# EAGLE design Particle-Photon-Carrier (EAGLE 9.6.2)
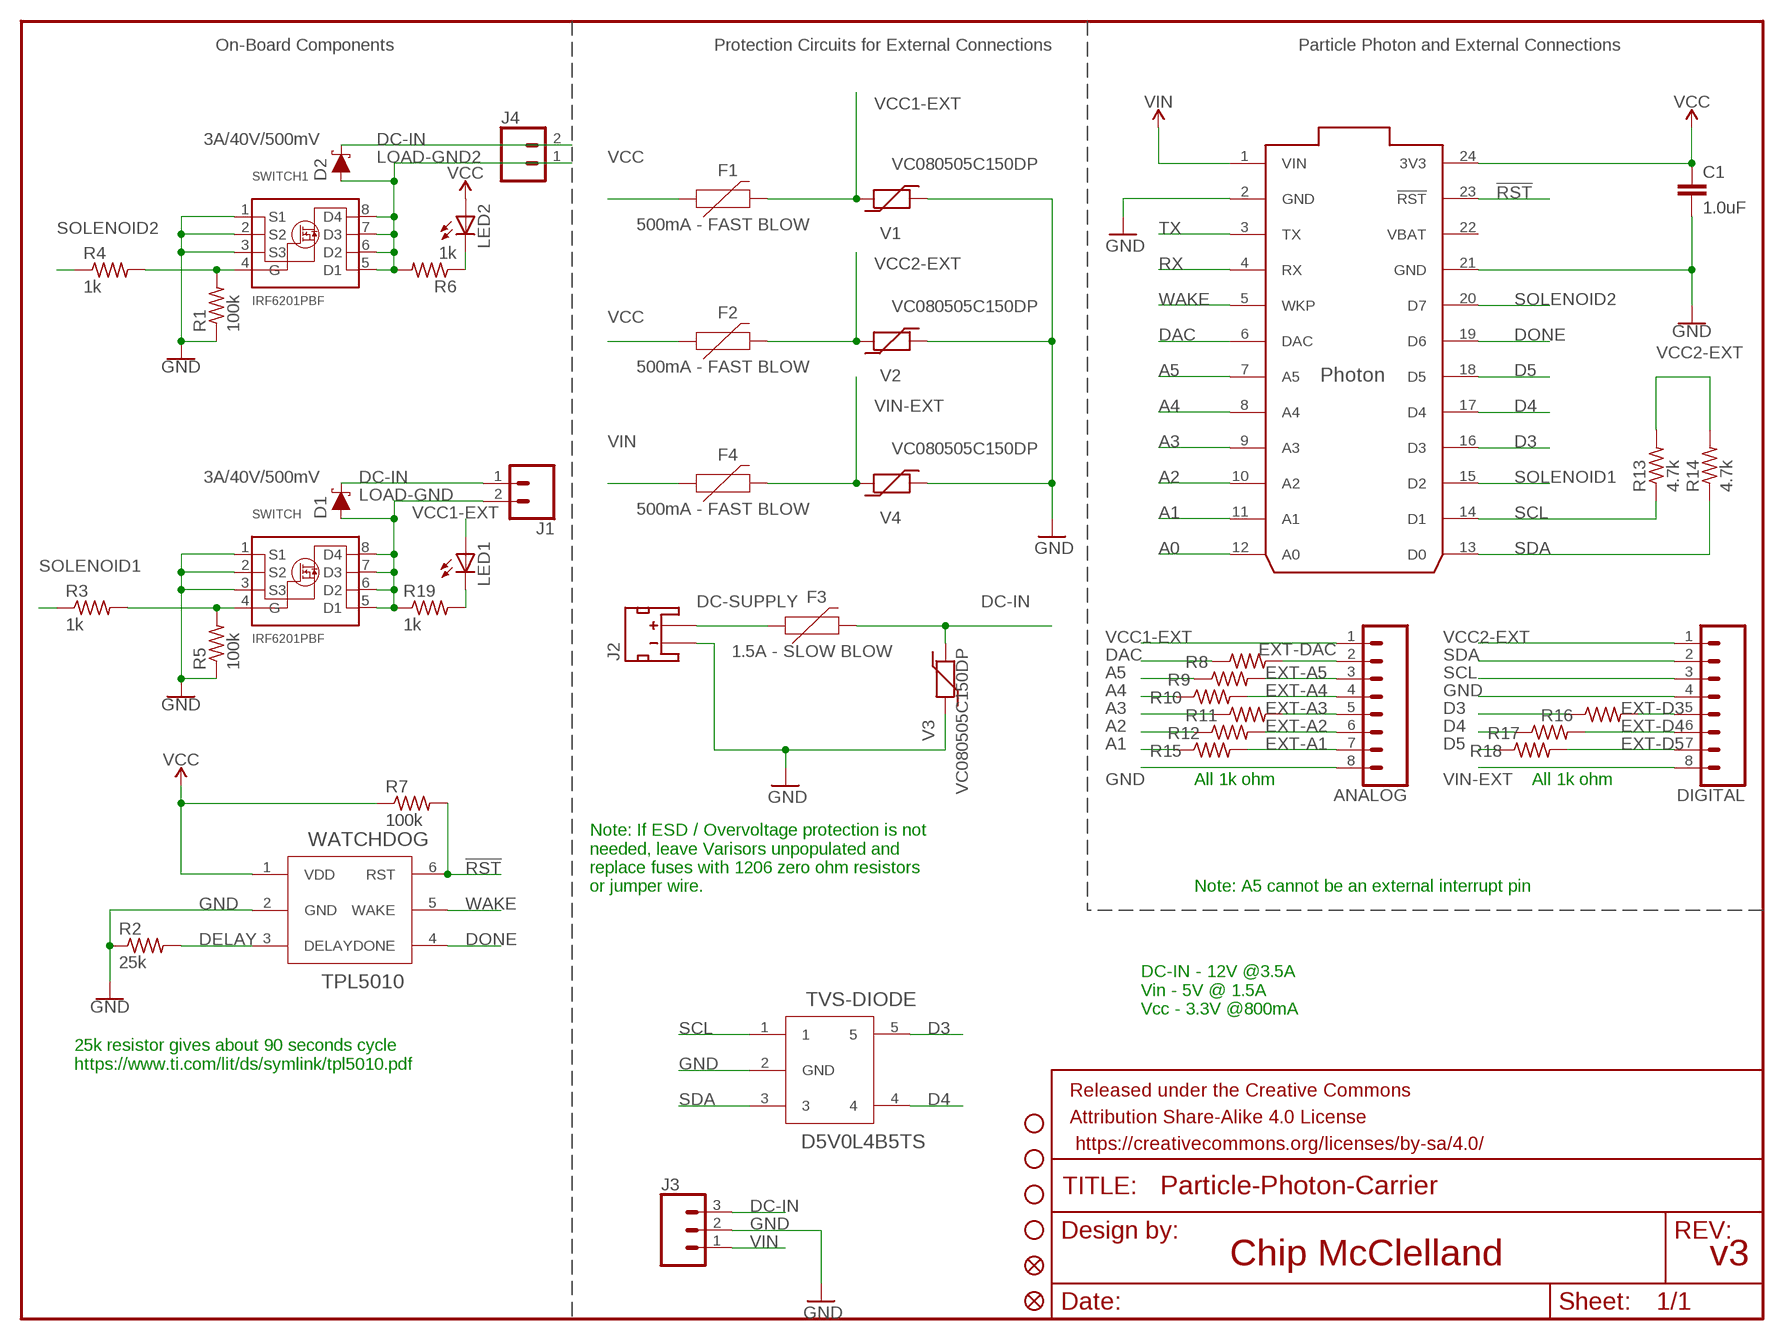
[diagram p0: schematic, sheet 1]

## Parts
ANALOG  CONN_083.5MM-8  [SCREWTERMINAL-3.5MM-8]
C1  1.0uF  1.0UF-0805-25V-10%  [0805]
D1  3A/40V/500mV  DIODE-SCHOTTKY-B340A  [SMA-DIODE]
D2  3A/40V/500mV  DIODE-SCHOTTKY-B340A  [SMA-DIODE]
DIGITAL  CONN_083.5MM-8  [SCREWTERMINAL-3.5MM-8]
F1  500mA - FAST BLOW  PPTC_HALF-AMP  [1206]
F2  500mA - FAST BLOW  PPTC_HALF-AMP  [1206]
F3  1.5A - SLOW BLOW  PPTC_HALF-AMP  [1206]
F4  500mA - FAST BLOW  PPTC_HALF-AMP  [1206]
FD1  FIDUCIALUFIDUCIAL  [FIDUCIAL-MICRO]
FD2  FIDUCIALUFIDUCIAL  [FIDUCIAL-MICRO]
FRAME1  FRAME-LETTER  [CREATIVE_COMMONS]
J1  CONN_023.5MM  [SCREWTERMINAL-3.5MM-2]
J2  5V @ 2A  JST_2MM_MALE  [JST-2-SMD]
J3  CONN_03LOCK  [1X03_LOCK]
J4  CONN_023.5MM  [SCREWTERMINAL-3.5MM-2]
JP3  STAND-OFF  [STAND-OFF]
JP4  STAND-OFF  [STAND-OFF]
JP5  STAND-OFF  [STAND-OFF]
JP6  STAND-OFF  [STAND-OFF]
LED1  LEDCHIPLED_0805  [CHIPLED_0805]
LED2  LEDCHIPLED_0805  [CHIPLED_0805]
PHOTON  PHOTON_WITH_HEADERS  [PHOTON]
R1  100k  R-US_R0805  [R0805]
R2  25k  R-US_R0805  [R0805]
R3  1k  R-US_R0805  [R0805]
R4  1k  R-US_R0805  [R0805]
R5  100k  R-US_R0805  [R0805]
R6  1k  R-US_R0805  [R0805]
R7  100k  R-US_R0805  [R0805]
R8  1k  R-US_R0805  [R0805]
R9  1k  R-US_R0805  [R0805]
R10  1k  R-US_R0805  [R0805]
R11  1k  R-US_R0805  [R0805]
R12  1k  R-US_R0805  [R0805]
R13  4.7k  R-US_R0805  [R0805]
R14  4.7k  R-US_R0805  [R0805]
R15  1k  R-US_R0805  [R0805]
R16  1k  R-US_R0805  [R0805]
R17  1k  R-US_R0805  [R0805]
R18  1k  R-US_R0805  [R0805]
R19  1k  R-US_R0805  [R0805]
SWITCH  IRF6201PBF  [SO8-GW300]
SWITCH1  IRF6201PBF  [SO8-GW300]
TVS-DIODE  D5V0L4B5TS  [SOT-23-5]
V1  VC080505C150DP  VARISTOR  [0805]
V2  VC080505C150DP  VARISTOR  [0805]
V3  VC080505C150DP  VARISTOR  [0805]
V4  VC080505C150DP  VARISTOR  [0805]
WATCHDOG  TPL5010  [TSOT-23]

## Nets
!RST: PHOTON.23(!RST) R7.2 WATCHDOG.6(RST)
A0: PHOTON.12(A0)
A1: PHOTON.11(A1) R15.1
A2: PHOTON.10(A2) R12.1
A3: PHOTON.9(A3) R11.1
A4: PHOTON.8(A4) R10.1
A5: PHOTON.7(A5) R9.1
D3: PHOTON.16(D3) R16.1 TVS-DIODE.5
D4: PHOTON.17(D4) R17.1 TVS-DIODE.4
D5: PHOTON.18(D5) R18.1
DAC: PHOTON.6(DAC) R8.1
DC-IN: D1.C D2.C F3.2 J1.1 J3.3 J4.2 V3.2
DC-SUPPLY: F3.1 J2.2(+)
DELAY: R2.2 WATCHDOG.3(DELAY)
DONE: PHOTON.19(D6) WATCHDOG.4(DONE)
EXT-A1: ANALOG.7 R15.2
EXT-A2: ANALOG.6 R12.2
EXT-A3: ANALOG.5 R11.2
EXT-A4: ANALOG.4 R10.2
EXT-A5: ANALOG.3 R9.2
EXT-D3: DIGITAL.5 R16.2
EXT-D4: DIGITAL.6 R17.2
EXT-D5: DIGITAL.7 R18.2
EXT-DAC: ANALOG.2 R8.2
GATE: R3.2 R5.2 SWITCH.4(G)
GATE1: R1.2 R4.2 SWITCH1.4(G)
GND: ANALOG.8 C1.2 DIGITAL.4 J2.1(-) J3.2 PHOTON.2(GND) PHOTON.21(GND) R1.1 R2.1 R5.1 SWITCH1.1(S1) SWITCH1.2(S2) SWITCH1.3(S3) SWITCH.1(S1) SWITCH.2(S2) SWITCH.3(S3) TVS-DIODE.2(GND) V1.1 V2.1 V3.1 V4.1 WATCHDOG.2(GND)
LOAD-GND: D1.A J1.2 R19.1 SWITCH.5(D1) SWITCH.6(D2) SWITCH.7(D3) SWITCH.8(D4)
LOAD-GND2: D2.A J4.1 R6.2 SWITCH1.5(D1) SWITCH1.6(D2) SWITCH1.7(D3) SWITCH1.8(D4)
N$1: LED2.C R6.1
N$2: LED1.C R19.2
RX: PHOTON.4(RX)
SCL: DIGITAL.3 PHOTON.14(D1) R13.1 TVS-DIODE.1
SDA: DIGITAL.2 PHOTON.13(D0) R14.1 TVS-DIODE.3
SOLENOID1: PHOTON.15(D2) R3.1
SOLENOID2: PHOTON.20(D7) R4.1
TX: PHOTON.3(TX)
VCC: C1.1 F1.1 F2.1 LED2.A PHOTON.24(3V3) R7.1 WATCHDOG.1(VDD)
VCC1-EXT: ANALOG.1 F1.2 LED1.A V1.2
VCC2-EXT: DIGITAL.1 F2.2 R13.2 R14.2 V2.2
VIN: F4.1 J3.1 PHOTON.1(VIN)
VIN-EXT: DIGITAL.8 F4.2 V4.2
WAKE: PHOTON.5(WKP) WATCHDOG.5(WAKE)
Unconnected: J2.NC1(PAD1) J2.NC2(PAD2)

## Notes on the sheet
- On-Board Components | Protection Circuits for External Connections | Particle Photon and External Connections
- All 1k ohm | All 1k ohm
- Note: If ESD / Overvoltage protection is not 
  needed, leave Varisors unpopulated and
  replace fuses with 1206 zero ohm resistors
  or jumper wire.
- Note: A5 cannot be an external interrupt pin
- DC-IN - 12V @3.5A
  Vin - 5V @ 1.5A
  Vcc - 3.3V @800mA
- 25k resistor gives about 90 seconds cycle
  https://www.ti.com/lit/ds/symlink/tpl5010.pdf
- Chip McClelland | v3

## Power pins joined to a net without a drawn wire
VBAT: PHOTON.22(VBAT)

## Library data of the parts
ANALOG DIGITAL = SparkFun-Connectors:CONN_08: Multi connection point. Often used as Generic Header-pin footprint for 0.1 inch spaced/style header connections On any of the 0.1 inch spaced packages, you can populate with these: Break Away Headers - Straight <https://www.sparkfun.com/products/116> (PRT-00116) Break Away Male Headers - Right Angle <https://www.sparkfun.com/products/553> (PRT-00553) Female Headers <https://www.sparkfun.com/products/115> (PRT-00115) Break Away Headers - Machine Pin <https://www.sparkfun.com/products/117> (PRT-00117) Break Away Female Headers - Swiss Machine Pin <https://www.sparkfun.com/products/743> (PRT-00743) Arduino Stackable Header - 8 Pin <https://www.sparkfun.com/products/9279> (PRT-09279) For SCREWTERMINALS and SPRING TERMINALS visit here: Screw Terimnals on SparkFun.com <https://www.sparkfun.com/search/results?term=Screw+Terminals> (5mm/3.5mm/2.54mm spacing) This device is also useful as a general connection point to wire up your design to another part of your project. Our various solder wires solder well into these plated through hole pads. Hook-Up Wire - Assortment (Stranded, 22 AWG) <https://www.sparkfun.com/products/11375> (PRT-11375) Hook-Up Wire - Assortment (Solid Core, 22 AWG) <https://www.sparkfun.com/products/11367> (PRT-11367) View the entire wire category on our website here <https://www.sparkfun.com/categories/141> Special notes: Molex polarized connector foot print use with SKU : PRT-08231 with associated crimp pins and housings. 1MM SMD Version SKU: PRT-10208 NOTES ON THE VARIANTS LOCK and LOCK_LONGPADS... This footprint was designed to help hold the alignment of a through-hole component (i.e. 6-pin header) while soldering it into place. You may notice that each hole has been shifted either up or down by 0.005 of an inch from it's more standard position (which is a perfectly straight line). This slight alteration caused the pins (the squares in the middle) to touch the edges of the holes. Because they are alternating, it causes a "brace" to hold the component in place. 0.005 has proven to be the perfect amount of "off-center" position when using our standard breakaway headers. Although looks a little odd when you look at the bare footprint, once you have a header in there, the alteration is very hard to notice. Also,if you push a header all the way into place, it is covered up entirely on the bottom side.
C1 = SparkFun-Capacitors:1.0UF: 1µF ceramic capacitors A capacitor is a passive two-terminal electrical component used to store electrical energy temporarily in an electric field.; PROD_ID: CAP-08064
D1 D2 = SparkFun-DiscreteSemi:DIODE-SCHOTTKY: Schottky diode A Schottky diode is a semiconductor diode which has a low forward voltage drop and a very fast switching action.; PROD_ID: DIO-09886
F1-F4 = SparkFun-Fuses:PPTC: Resettable Fuse PPTC Resettable Fuse. Really a sort of resistor with a polymeric positive temperature coefficient whose resistance increases dramatically with an increase in temperature. When heated by the power passing through the resistance rises causing the current to be limited, protecting the circuit. This is achieved by the transition of the polymer from a crystalline to an amorphous state where the conductive carbon separates breaking the conductive pathways found in the cool crystalline structure. When a PPTC cools back down it resumes conducting letting the circuit turn back on. SparkFun Products: SparkFun RedBoard - Programmed with Arduino <https://www.sparkfun.com/products/12757> Pro Micro - 5V/16MHz <https://www.sparkfun.com/products/12640> Arduino Pro 328 - 5V/16MHz <https://www.sparkfun.com/products/10915> MP3 Trigger <https://www.sparkfun.com/products/13720>; PROD_ID: RES-08585; VALUE: 6V/0.5A
FD1 FD2 = SparkFun-Aesthetics:FIDUCIAL: Fiducial Alignment Points Point-of-reference for pick-and-place machines and other optical instruments.
FRAME1 = SparkFun-Aesthetics:FRAME-LETTER: Schematic Frame - Letter Standard 8.5x11 US Letter frame
J1 J4 = SparkFun-Connectors:CONN_02: Multi connection point. Often used as Generic Header-pin footprint for 0.1 inch spaced/style header connections On any of the 0.1 inch spaced packages, you can populate with these: Break Away Headers - Straight <https://www.sparkfun.com/products/116> (PRT-00116) Break Away Male Headers - Right Angle <https://www.sparkfun.com/products/553> (PRT-00553) Female Headers <https://www.sparkfun.com/products/115> (PRT-00115) Break Away Headers - Machine Pin <https://www.sparkfun.com/products/117> (PRT-00117) Break Away Female Headers - Swiss Machine Pin <https://www.sparkfun.com/products/743> (PRT-00743) For SCREWTERMINALS and SPRING TERMINALS visit here: Screw Terimnals on SparkFun.com <https://www.sparkfun.com/search/results?term=Screw+Terminals> (5mm/3.5mm/2.54mm spacing) This device is also useful as a general connection point to wire up your design to another part of your project. Our various solder wires solder well into these plated through hole pads. Hook-Up Wire - Assortment (Stranded, 22 AWG) <https://www.sparkfun.com/products/11375> (PRT-11375) Hook-Up Wire - Assortment (Solid Core, 22 AWG) <https://www.sparkfun.com/products/11367> (PRT-11367) View the entire wire category on our website here <https://www.sparkfun.com/categories/141> Special notes: Molex polarized connector foot print use with: PRT-08233 with associated crimp pins and housings. 2.54_SCREWTERM for use with PRT-10571. 3.5mm Screw Terminal footprints for PRT-08084 5mm Screw Terminal footprints for use with PRT-08432; PROD_ID: CONN-08399
J2 = SparkFun-Connectors:JST_2MM_MALE: JST 2MM MALE RA CONNECTOR Two pin, compact surface mount connector. Commonly used as a battery input connection point. We really like the solid locking feeling and high current rating on these small connectors. We use these all the time as battery connectors. Mates to single-cell LiPo batteries. Here is the connector we sell at SparkFun: JST Right Angle Connector - White <https://www.sparkfun.com/products/8612> (PRT-08612) Datasheet <http://www.sparkfun.com/datasheets/Prototyping/Connectors/JST-Horizontal.pdf> It was used on these SparkFun products: SparkFun MOSFET Power Controller <https://www.sparkfun.com/products/11214> (PRT-11214) SparkFun Battery Babysitter - LiPo Battery Manager <https://www.sparkfun.com/products/13777> (PRT-13777) And many, many others that required a lipo battery connection.; PROD_ID: CONN-11443; SF_ID: PRT-08612
J3 = SparkFun-Connectors:CONN_03: Multi connection point. Often used as Generic Header-pin footprint for 0.1 inch spaced/style header connections On any of the 0.1 inch spaced packages, you can populate with these: Break Away Headers - Straight <https://www.sparkfun.com/products/116> (PRT-00116) Break Away Male Headers - Right Angle <https://www.sparkfun.com/products/553> (PRT-00553) Female Headers <https://www.sparkfun.com/products/115> (PRT-00115) Break Away Headers - Machine Pin <https://www.sparkfun.com/products/117> (PRT-00117) Break Away Female Headers - Swiss Machine Pin <https://www.sparkfun.com/products/743> (PRT-00743) Stackable Header - 3 Pin (Female, 0.1") <https://www.sparkfun.com/products/13875> (PRT-13875) For SCREWTERMINALS and SPRING TERMINALS visit here: Screw Terimnals on SparkFun.com <https://www.sparkfun.com/search/results?term=Screw+Terminals> (5mm/3.5mm/2.54mm spacing) This device is also useful as a general connection point to wire up your design to another part of your project. Our various solder wires solder well into these plated through hole pads. Hook-Up Wire - Assortment (Stranded, 22 AWG) <https://www.sparkfun.com/products/11375> (PRT-11375) Hook-Up Wire - Assortment (Solid Core, 22 AWG) <https://www.sparkfun.com/products/11367> (PRT-11367) View the entire wire category on our website here <https://www.sparkfun.com/categories/141> Special notes: Molex polarized connector foot print use with SKU : PRT-08232 with associated crimp pins and housings.
JP3-JP6 = SparkFun:STAND-OFF: Stand Off This is the mechanical footprint for a #4 phillips button head screw. Use the keepout ring to avoid running the screw head into surrounding components. SKU : PRT-00447
LED1 LED2 = adafruit:LED: LED OSRAM: - CHIPLED LG R971, LG N971, LY N971, LG Q971, LY Q971, LO R971, LY R971 LH N974, LH R974 LS Q976, LO Q976, LY Q976 LO Q996 - Hyper CHIPLED LW Q18S LB Q993, LB Q99A, LB R99A - SideLED LS A670, LO A670, LY A670, LG A670, LP A670 LB A673, LV A673, LT A673, LW A673 LH A674 LY A675 LS A676, LA A676, LO A676, LY A676, LW A676 LS A679, LY A679, LG A679 - Hyper Micro SIDELED® LS Y876, LA Y876, LO Y876, LY Y876 LT Y87S - SmartLED LW L88C, LW L88S LB L89C, LB L89S, LG L890 LS L89K, LO L89K, LY L89K LS L896, LA L896, LO L896, LY L896 - TOPLED LS T670, LO T670, LY T670, LG T670, LP T670 LSG T670, LSP T670, LSY T670, LOP T670, LYG T670 LG T671, LOG T671, LSG T671 LB T673, LV T673, LT T673, LW T673 LH T674 LS T676, LA T676, LO T676, LY T676, LB T676, LH T676, LSB T676, LW T676 LB T67C, LV T67C, LT T67C, LS T67K, LO T67K, LY T67K, LW E67C LS E67B, LA E67B, LO E67B, LY E67B, LB E67C, LV E67C, LT E67C LW T67C LS T679, LY T679, LG T679 LS T770, LO T770, LY T770, LG T770, LP T770 LB T773, LV T773, LT T773, LW T773 LH T774 LS E675, LA E675, LY E675, LS T675 LS T776, LA T776, LO T776, LY T776, LB T776 LHGB T686 LT T68C, LB T68C - Hyper Mini TOPLED® LB M676 - Mini TOPLED Santana® LG M470 LS M47K, LO M47K, LY M47K Source: http://www.osram.convergy.de/
PHOTON = Particle-Devices:PHOTON: Particle Photon Wi-Fi through-hole development board footprint
R1-R19 = adafruit:R-US_: RESISTOR, American symbol
SWITCH SWITCH1 = MOSFETs:IRF6201PBF: IRF6201 - N-MOSFET Specifications from: http://www.irf.com/product-info/datasheets/data/irf6201pbf.pdf By Chip McClelland chip@mcclellands.org
TVS-DIODE = Custom Components:D5V0L4B5TS: 4 CHANNEL LOW CAPACITANCE BI-DIRECTIONAL TVS ARRAY
V1-V4 = Custom Components:VARISTOR
WATCHDOG = Custom Components:TPL5010

## Net classes
0 default: width 0.203 mm, drill 0.33 mm

## Board
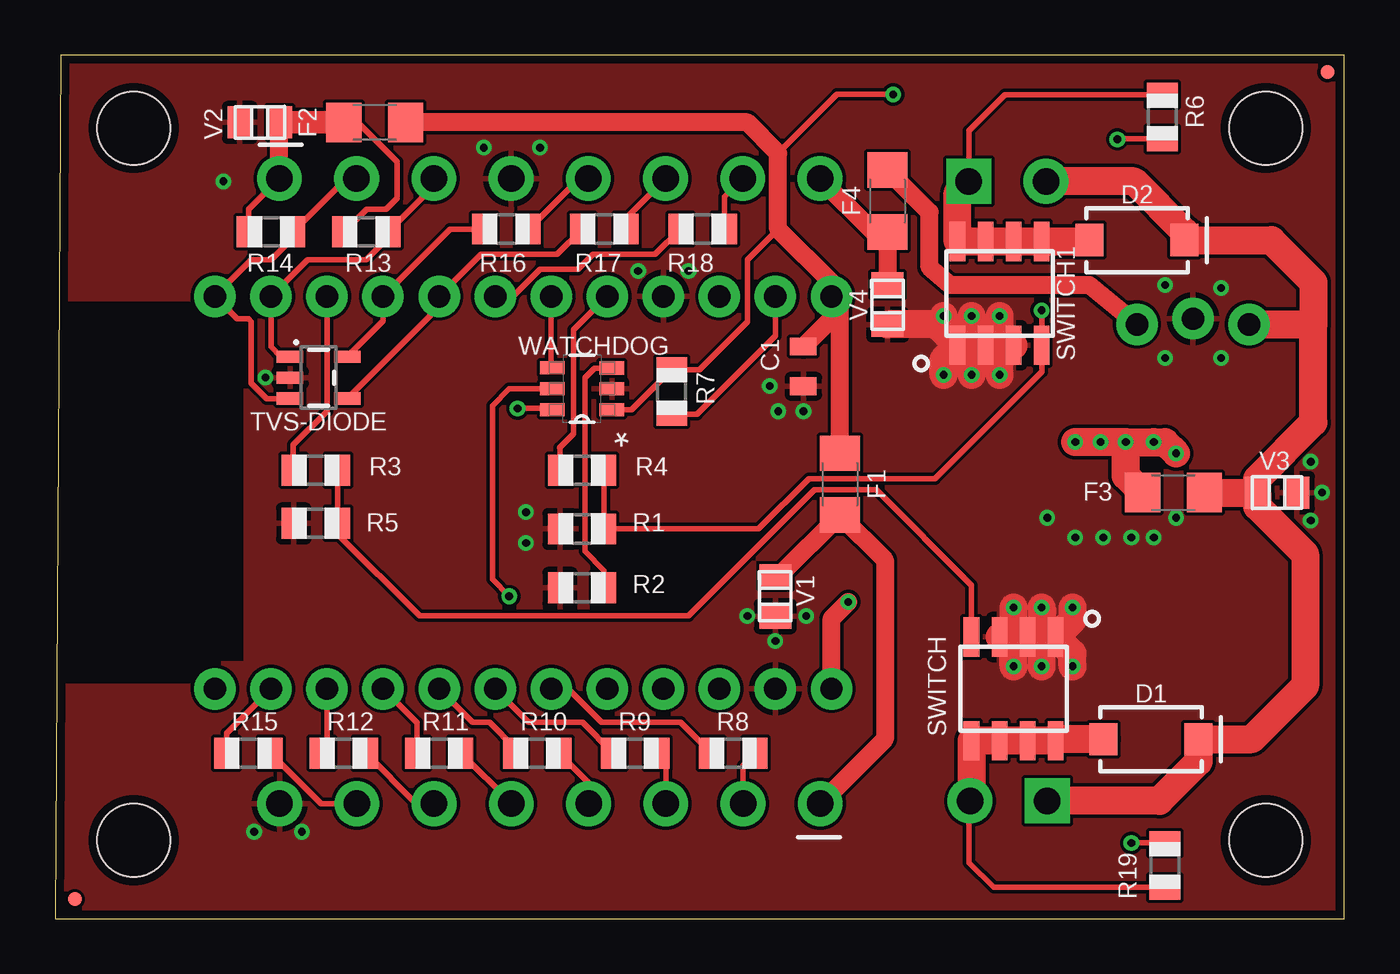
[diagram p1: board, top side]
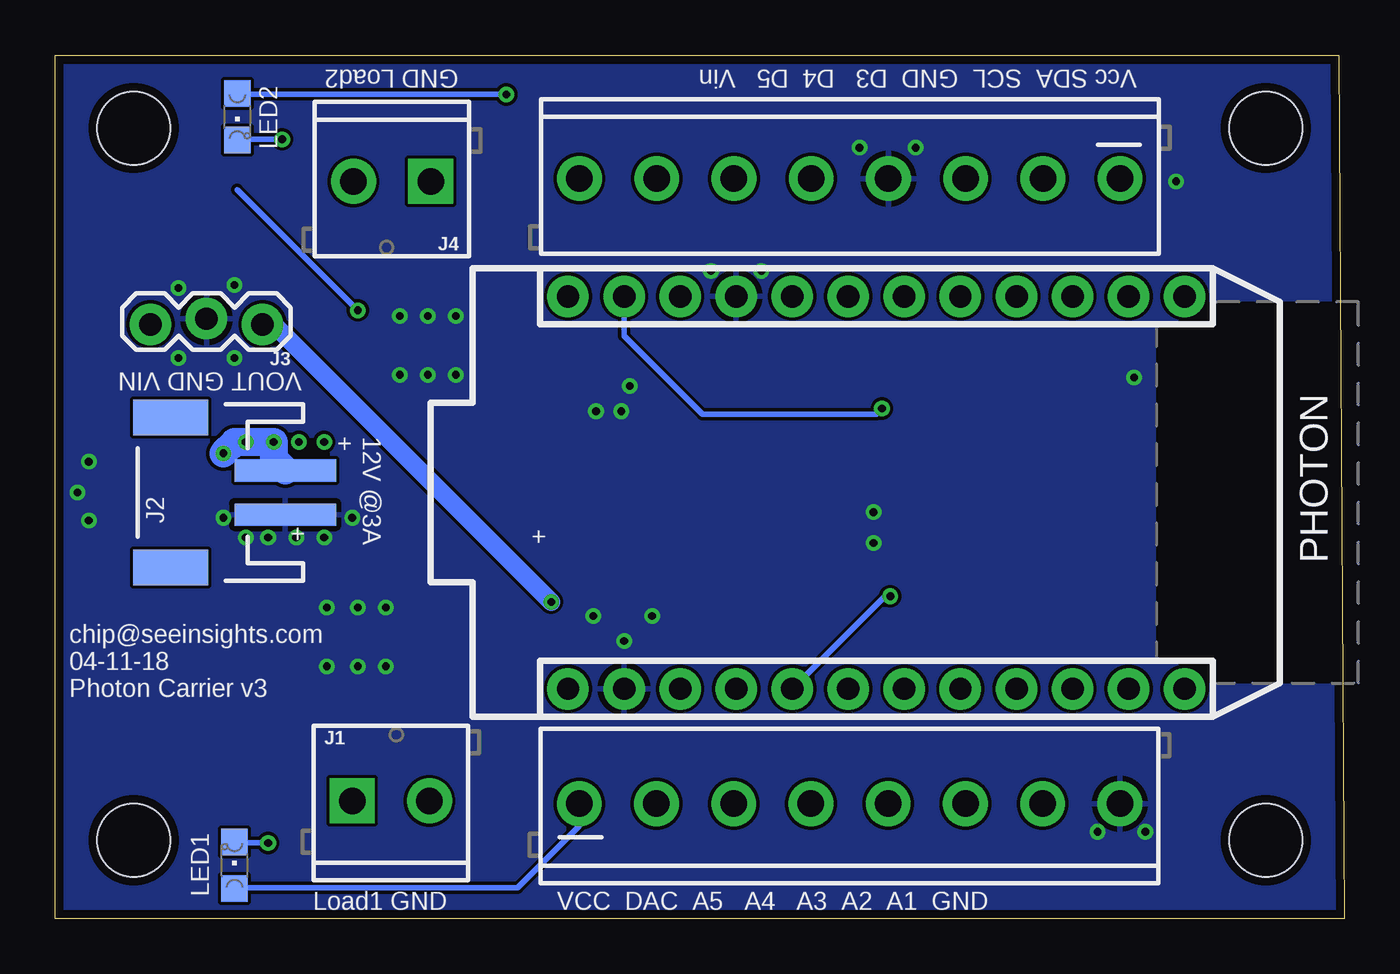
[diagram p2: board, bottom side, seen from below]

Size 58.42 x 39.12 mm. Coordinates in mm from the lower left corner, seen from the top.
Outline: 0,0 58.42,0 58.42,39.12 0.25,39.12 0,0
Copper layers (1*16): Top 0.0356mm / dielectric 1.5011mm / Bottom 0.0356mm
Design rules "oshpark-2layer": minimum track width 6mil, minimum drill 13mil, track to track 6mil, track to pad 6mil, pad to pad 6mil, via to via 6mil, smd to smd 6mil, copper to edge 15mil, drill to drill 6mil, minimum pad ring 7mil, minimum via ring 7mil, stop-mask expansion 2.5mil, vias tented up to drill 0mil, thermal gap 10mil

### Footprints (pad centres in the part's own frame; a part is rotated, then mirrored left to right if it is on the bottom)
SCREWTERMINAL-3.5MM-8 = drill 1.2 pad 2.032: 1 0,0; 2 3.5,0; 3 7,0; 4 10.5,0; 5 14,0; 6 17.5,0; 7 21,0; 8 24.5,0
0805 = smd 0.8 x 1.2: 1 -0.9,0; 2 0.9,0
SMA-DIODE = smd 1.27 x 1.47: A -2.15,0; C 2.15,0
1206 = smd 1.6 x 1.8: 1 -1.4,0; 2 1.4,0
FIDUCIAL-MICRO = smd 0.635 x 0.635: 1 0,0
SCREWTERMINAL-3.5MM-2 = drill 1.2 pad 2.032 square: 1 0,0 | drill 1.2 pad 2.032: 2 3.5,0
JST-2-SMD = smd 1 x 4.6: 1 -1,-3.7; 2 1,-3.7 | smd 1.6 x 3.4: NC1 -3.4,1.5; NC2 3.4,1.5
1X03_LOCK = drill 1.016 pad 1.88: 1 0,0.127; 2 2.54,-0.127; 3 5.08,0.127
STAND-OFF = hole 3.302: 0,0
CHIPLED_0805 = smd 1.2 x 1.2: A 0,-1.05; C 0,1.05
PHOTON = drill 1.016 pad 1.88: 1 1.27,33.02; 2 1.27,30.48; 3 1.27,27.94; 4 1.27,25.4; 5 1.27,22.86; 6 1.27,20.32; 7 1.27,17.78; 8 1.27,15.24; 9 1.27,12.7; 10 1.27,10.16; 11 1.27,7.62; 12 1.27,5.08; 13 19.05,5.08; 14 19.05,7.62; 15 19.05,10.16; 16 19.05,12.7; 17 19.05,15.24; 18 19.05,17.78; 19 19.05,20.32; 20 19.05,22.86; 21 19.05,25.4; 22 19.05,27.94; 23 19.05,30.48; 24 19.05,33.02
R0805 = smd 1.1 x 1.4: 1 -1,0; 2 1,0
SO8-GW300 = smd 1.78 x 0.72: 1 -2.349,1.905; 2 -2.349,0.635; 3 -2.349,-0.635; 4 -2.349,-1.905; 5 2.349,-1.905; 6 2.349,-0.635; 7 2.349,0.635; 8 2.349,1.905
SOT-23-5 = smd 0.55 x 1.2: 1 -0.95,-1.3; 2 0,-1.3; 3 0.95,-1.3; 4 0.95,1.3; 5 -0.95,1.3
0805' = smd 1.118 x 1.448: 1 -0.902,0; 2 0.902,0
TSOT-23 = smd 1.1 x 0.6: 1 -1.35,0.95; 2 -1.35,0; 3 -1.35,-0.94; 4 1.35,-0.95; 5 1.35,0; 6 1.35,0.95

### Placement (x,y rotation side)
ANALOG  34.67,5.21 0 bottom
C1  33.91,25.02 270 top
D1  49.66,8.13 0 top
D2  49.02,30.73 0 top
DIGITAL  10.16,33.53 180 bottom
F1  35.56,19.68 270 top
F2  14.48,36.07 180 top
F3  50.67,19.3 0 top
F4  37.72,32.51 270 top
FD1  0.89,0.89 0 top
FD2  57.66,38.35 0 top
FRAME1  17.78,-11.43 0 top  (outside the outline)
J1  44.96,5.33 0 bottom
J2  51.69,19.3 90 bottom
J3  49.02,27.05 180 bottom
J4  41.4,33.4 180 bottom
JP3  3.56,35.81 0 top
JP4  54.86,3.56 0 top
JP5  54.86,35.81 0 top
JP6  3.56,3.56 0 top
LED1  50.29,2.41 0 bottom
LED2  50.16,36.32 180 bottom
PHOTON  2.16,9.14 90 bottom
R1  23.88,17.65 0 top
R2  23.88,14.99 0 top
R3  11.81,20.32 0 top
R4  23.88,20.32 0 top
R5  11.81,17.91 0 top
R6  50.16,36.32 90 top
R7  27.94,23.88 270 top
R8  30.73,7.49 0 top
R9  26.29,7.49 0 top
R10  21.84,7.49 0 top
R11  17.4,7.49 0 top
R12  13.08,7.49 0 top
R13  14.1,31.11 180 top
R14  9.78,31.11 180 top
R15  8.76,7.49 0 top
R16  20.45,31.24 0 top
R17  24.89,31.24 0 top
R18  29.34,31.24 0 top
R19  50.29,2.41 90 top
SWITCH  43.43,10.41 270 top
SWITCH1  42.8,28.32 90 top
TVS-DIODE  11.94,24.51 270 top
V1  VC080505C150DP  [0805']  32.64,14.61 90 top
V2  VC080505C150DP  [0805']  9.27,36.07 0 top
V3  VC080505C150DP  [0805']  55.37,19.3 180 top
V4  VC080505C150DP  [0805']  37.72,27.81 90 top
WATCHDOG  23.88,24 180 top

### Tracks (layer width: path | path; a pad name or v marks a point on that pad's centre or on a via)
!RST  (via drill 0.35)
  Top 0.254: PHOTON.23 32.64,26.42 29.08,22.86 27.96,22.86 R7.2 | v20.95,23.11 22.46,23.11 WATCHDOG.6
  Bottom 0.254: PHOTON.23 32.64,26.42 29.08,22.86 21.21,22.86 v20.95,23.11
A1
  Top 0.254: PHOTON.11 7.76,8.4 R15.1
A2
  Top 0.254: PHOTON.10 12.32,7.73 R12.1
A3
  Top 0.254: PHOTON.9 16.4,8.87 R11.1
A4
  Top 0.254: PHOTON.8 18.92,8.89 19.68,8.89 20.84,7.73 R10.1
A5
  Top 0.254: PHOTON.7 21.46,8.89 23.89,8.89 R9.1
D3
  Top 0.254: TVS-DIODE.5 14.86,27.08 PHOTON.16 17.91,31.24 R16.1
D4
  Top 0.254: TVS-DIODE.4 17.4,27.72 PHOTON.17 19.3,30.1 22.75,30.1 R17.1
D5
  Top 0.254: PHOTON.18 20.75,28.19 21.97,29.41 23.7,29.41 24.38,30.1 27.19,30.1 R18.1
DAC
  Top 0.254: PHOTON.6 23.24,10.41 24.77,8.89 28.34,8.89 R8.1
DC-IN
  Top 0.813: D1.C 51.94,8.13 | 51.31,30.87 D2.C
  Top 1.27: 57.02,26.92 57.02,28.83 55.12,30.73 D2.C 51.17,31.12 48.9,33.4 J4.2 | J3.3 57.02,26.92 | J1.1 50.04,5.33 51.81,7.1 D1.C 54.23,8.13 56.64,10.54 56.64,16.51 54.47,18.68 V3.2 | F3.2 V3.2 | V3.2 54.47,19.93 57.02,22.48 57.02,26.92
DC-SUPPLY  (via drill 0.35)
  Top 1.27: F3.1 48.51,20.06 v48.51,21.59 | v48.51,21.59 v47.37,21.59 v46.23,21.59 | v48.51,21.59 v49.78,21.59 50.29,21.59 v50.8,21.08
  Bottom 1.27: v50.8,21.08 50.29,21.59 v49.78,21.59 v48.51,21.59 48.51,20.83 J2.2
DELAY
  Top 0.254: R2.2 24.88,15.76 24,16.64 24,24.51 24.43,24.94 WATCHDOG.3
DONE
  Top 0.254: PHOTON.19 22.48,25 WATCHDOG.4
EXT-A1
  Top 0.254: R15.2 12.05,5.21 ANALOG.7
EXT-A2
  Top 0.254: R12.2 16.37,5.21 ANALOG.6
EXT-A3
  Top 0.254: R11.2 ANALOG.5
EXT-A4
  Top 0.254: R10.2 24.17,6.17 ANALOG.4
EXT-A5
  Top 0.254: R9.2 27.67,7.11 ANALOG.3
EXT-D3
  Top 0.254: R16.2 23.73,33.53 DIGITAL.5
EXT-D4
  Top 0.254: R17.2 25.89,31.76 DIGITAL.6
EXT-D5
  Top 0.254: R18.2 30.34,32.7 DIGITAL.7
EXT-DAC
  Top 0.254: R8.2 31.17,6.93 ANALOG.2
GATE
  Top 0.254: R3.2 R5.2 12.81,17.41 16.51,13.72 28.7,13.72 34.42,19.43 37.21,19.43 41.53,15.11 SWITCH.4
GATE1  (via drill 0.35)
  Top 0.254: R4.2 R1.2 31.88,17.65 34.16,19.94 39.88,19.94 44.7,24.77 SWITCH1.4 v44.7,27.56
  Bottom 0.254: v44.7,27.56 50.16,33.02
GND  (via drill 0.35)
  Top 0.813: 37.73,26.92 V4.1
  Top 1.27: SWITCH1.1 40.26,26.61 | 40.26,26.61 39.94,26.92 37.73,26.92 | SWITCH1.1 41.53,25.97 | 41.53,25.97 SWITCH1.2 | SWITCH1.2 42.8,25.97 | 42.8,25.97 SWITCH1.3 | v41.53,27.3 41.53,25.97 | v42.8,27.3 42.8,25.97 | v40.26,27.3 40.26,26.61 | v40.26,24.64 40.26,25.34 SWITCH1.1 | v41.53,24.64 41.53,25.34 SWITCH1.1 | v42.8,24.64 42.8,25.34 SWITCH1.2 | SWITCH.3 SWITCH.2 | SWITCH.2 44.7,12.76 | 44.7,12.76 SWITCH.1 | v43.43,11.43 43.43,12.13 SWITCH.2 | v44.7,11.43 44.7,12.13 SWITCH.2 | v46.1,11.43 46.1,12 SWITCH.1 | v46.1,14.1 46.1,13.53 SWITCH.1 | v44.7,14.1 44.7,12.76 | v43.43,14.1 43.43,13.4 SWITCH.2
  other vias: 11.18,3.94 9.02,3.94 7.62,33.4 44.96,18.16 46.23,17.27 49.78,17.27 48.77,17.27 47.5,17.27 50.8,18.16 56.9,18.03 56.9,20.7 57.4,19.3 9.53,24.51 50.29,28.7 52.83,28.57 52.83,25.4 50.29,25.4 34.04,13.72 31.37,13.72 32.64,12.57 26.42,29.34 28.7,29.34 21.97,34.92 19.43,34.92 21.34,18.41 21.34,17.02 33.91,22.99 32.77,22.99 32.38,24.13
  pour Top (rank 2): -1.14,41.91 62.74,41.02 62.61,-1.4 -1.52,-0.51
  pour Bottom (rank 2): -1.27,42.42 62.99,42.04 62.48,-0.89 -1.78,-0.51
LOAD-GND
  Top 0.152: 41.4,5.28 41.53,5.41
  Top 0.254: R19.1 42.53,1.41 41.4,2.54 41.4,5.28
  Top 0.813: 47.44,8.06 D1.A
  Top 1.27: D1.A 45.4,8.13 SWITCH.8 SWITCH.7 SWITCH.6 SWITCH.5 41.53,5.41 J1.2
LOAD-GND2
  Top 0.254: R6.2 43.04,37.32 41.4,35.69 J4.1
  Top 0.813: D2.A 46.81,30.67
  Top 1.27: 46.81,30.67 SWITCH1.5 SWITCH1.6 SWITCH1.7 SWITCH1.8 40.89,32.89 J4.1
N$1  (via drill 0.35)
  Top 0.254: R6.1 48.15,35.32 v48.13,35.31
  Bottom 0.254: v48.13,35.31 50.13,35.31 LED2.C
N$2  (via drill 0.35)
  Top 0.254: v48.77,3.43 50.28,3.43 R19.2
  Bottom 0.254: LED1.C 50.26,3.43 v48.77,3.43
SCL
  Top 0.254: TVS-DIODE.1 10.23,25.46 9.78,25.91 PHOTON.14 11.43,29.84 14.1,29.84 15.1,30.84 R13.1 17.16,33.18 DIGITAL.3
SDA
  Top 0.254: DIGITAL.2 13.19,33.53 R14.1 10.78,30.84 9.78,29.84 8.89,29.84 PHOTON.13 8.26,27.18 8.76,27.18 8.89,27.05 8.89,24.25 9.58,23.56 TVS-DIODE.3
SOLENOID1
  Top 0.254: PHOTON.15 12.32,22.99 10.79,21.46 10.79,20.34 R3.1
SOLENOID2
  Top 0.254: PHOTON.20 23.5,26.67 23.5,21.97 22.86,21.34 22.88,21.32 R4.1
VCC  (via drill 0.35)
  Top 0.254: 32.77,31.24 31.37,29.84 31.37,27.05 29.19,24.88 R7.1 26.12,23.05 WATCHDOG.1 | v37.97,37.34 35.43,37.34 32.77,34.67
  Top 0.406: PHOTON.24 35.19,28.2
  Top 0.813: 35.56,20.95 F1.1 35.56,27.84 35.19,28.2 | 35.19,28.2 35.19,28.82 32.77,31.24 32.77,34.67 31.37,36.07 F2.1 | C1.1 35.19,27.2 35.19,28.2
  Bottom 0.254: v37.97,37.34 50.13,37.34 LED2.A
VCC1-EXT
  Top 0.813: V1.2 32.78,15.51 F1.2 37.59,16.25 37.59,8.13 ANALOG.1
  Bottom 0.254: ANALOG.1 34.67,4.19 37.47,1.4 50.26,1.4 LED1.A
VCC2-EXT
  Top 0.254: R14.2 8.78,32.15 DIGITAL.1 | R13.2 14.11,32.13 14.99,32.13 15.49,32.64 15.49,34.29 13.72,36.07 F2.2
  Top 0.813: DIGITAL.1 10.16,36.05 V2.2
  Top 1.016: F2.2 V2.2
VIN  (via drill 0.35)
  Top 0.813: J3.1 46.86,28.7 40.57,28.7 39.62,29.52 39.62,32.01 F4.1 | PHOTON.1 35.18,13.59 v35.94,14.35
  Bottom 0.813: v35.94,14.35 48.51,26.92 J3.1
VIN-EXT
  Top 0.813: DIGITAL.8 37.08,31.11 F4.2 V4.2
WAKE  (via drill 0.35)
  Top 0.254: WATCHDOG.5 20.57,24 19.81,23.24 19.81,15.37 v20.57,14.61
  Bottom 0.254: v20.57,14.61 20.83,14.61 PHOTON.5

### Text on the board
bNames: Vcc SDA SCL GND D3 D4 D5 Vin | GND Load2 | VOUT GND VIN | 12V @3A / + | + | + | chip@seeinsights.com / 04-11-18 / Photon Carrier v3 | VCC DAC A5 A4 A3 A2 A1 GND | Load1 GND